# Altium schematic sheet Connector.SchDoc
size B
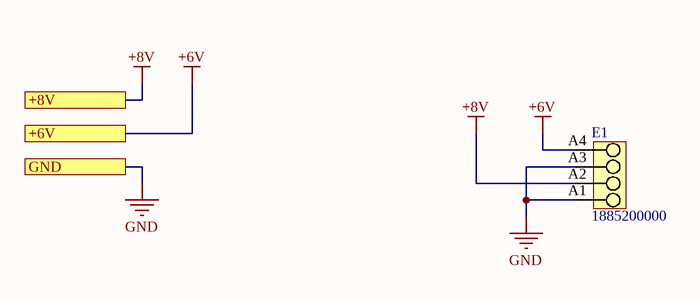
[diagram p0: Connector.SchDoc]

## Parts
E1  1885200000  [LSF_SMT_3_5_135_04]

## Ports
+6V, +8V, GND

## Nets
+6V: E1.A4 ; port +6V
+8V: E1.A2 ; port +8V
GND: E1.A1 E1.A3 ; port GND

## Library data of the parts
E1 = CMP-1559-02099-1: OMNIMATE Signal - series LSF; Manufacturer: Weidmueller; Pitch_inch: 0,138 inch; Contact_material: Cu-Leg; Mounting_onto_the_PCB: Reflow solder connection; Rated_voltage_use_group_B_UL_1059: 300 V; Side_termination_characteristic: closed side; Wire_cross_section_AWG_min_UL_1059: AWG 24; Solid_min_H05_07_V_U: 0,2 mm²; No_of_poles: 4; Pitch_mm: 3,5 mm; Solder_pin_length_mm: 1,5 mm; Wire_cross_section_AWG_max_UL_1059: AWG 16; Contact_surface: tinned; Solid_max_H05_07_V_U: 1,5 mm²; Short_text_for_material: LSF-SMT 3.50/04/135 1.5SN BK TU; Rated_current_min_no_of_poles_TU_20_deg_C: 19 A; Rated_current_use_group_B_UL_1059: 12 A; Rated_voltage_for_surge_voltage_class_pollution_degree_II_2: 320 V; Insulating_material: LCP GF; UL_94_flammability_rating: V-0; ComponentLink1URL: http://www.weidmueller.com/; ComponentLink1Description: Manufacturer URL; ComponentLink2URL: http://catalog.weidmueller.com/catalog/Start.do?localeId=en&ObjectID=1885200000; PackageReference: LSF_SMT_3_5_135_04; Qty: 37 PCS; Revision: V1; ComponentLink2Description: URL Link1; PartNumber: 1885200000; Packaging: Tube; Colour: Black